# Altium schematic sheet 00_Index.SchDoc
size A4; SheetNumber: 1; SheetTotal: 4
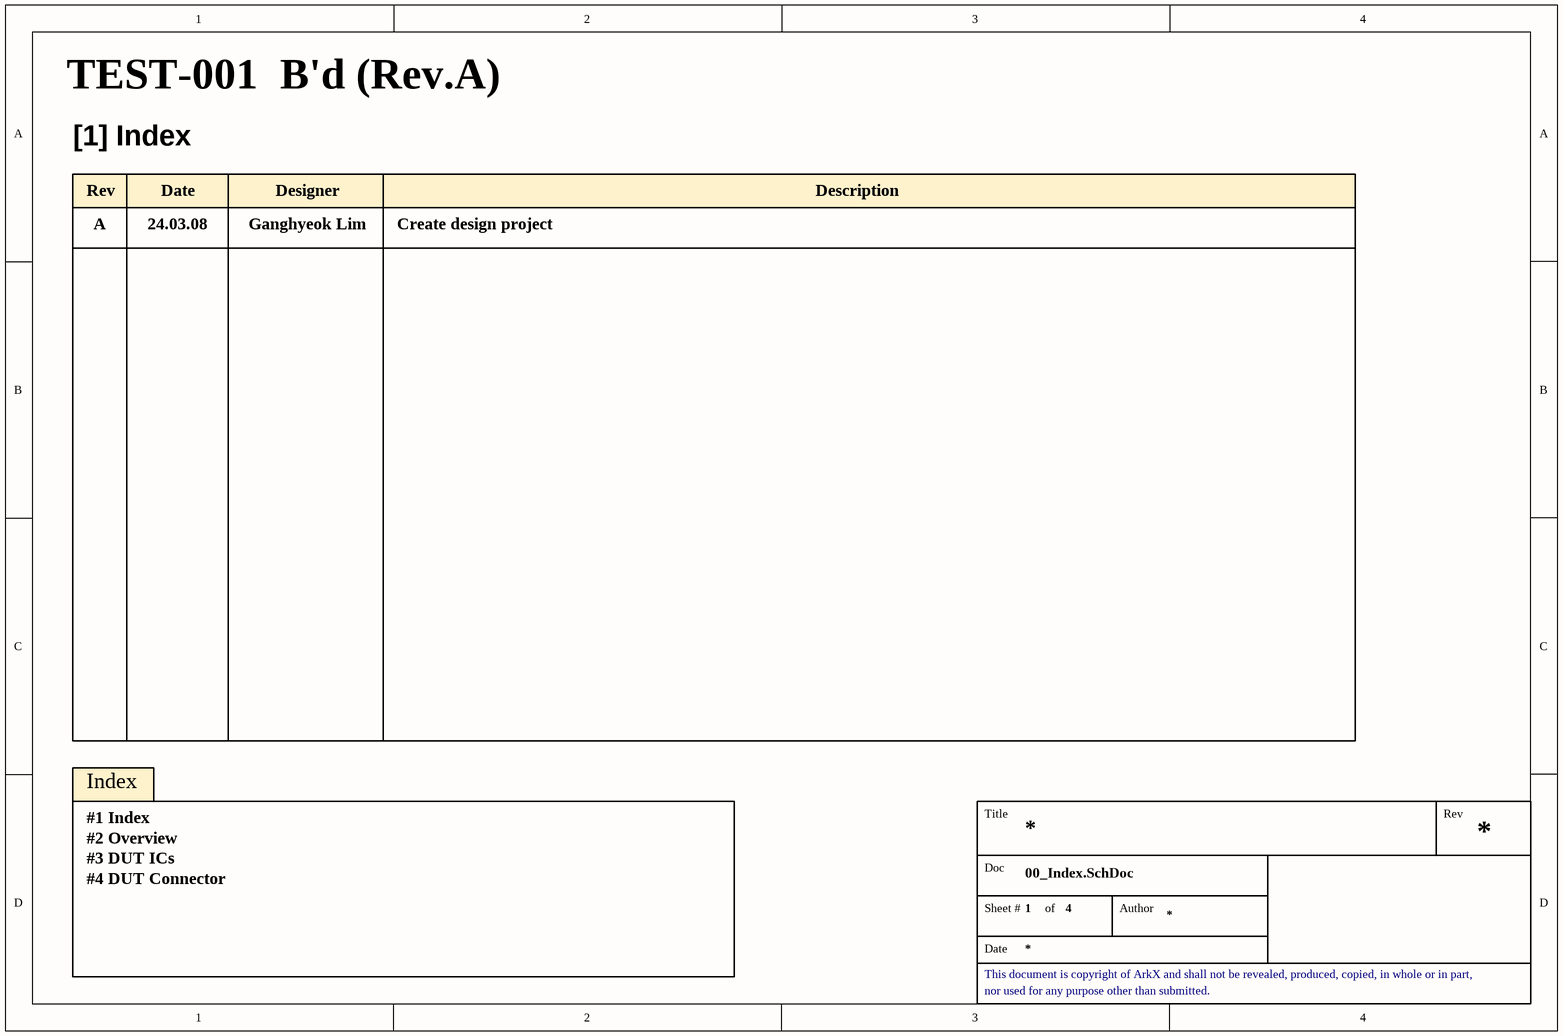
[diagram p0: 00_Index.SchDoc]

## Notes on the sheet
- TEST-001  B'd (Rev.A)
- [1] Index
- Rev
- A
- 24.03.08
- Date
- Ganghyeok Lim
- Designer
- Create design project
- Description
- Index
- #1 Index
- #2 Overview
- #3 DUT ICs
- #4 DUT Connector
- Title
- Doc
- Sheet #
- of
- Author
- This document is copyright of ArkX and shall not be revealed, produced, copied, in whole or in part,
- nor used for any purpose other than submitted.